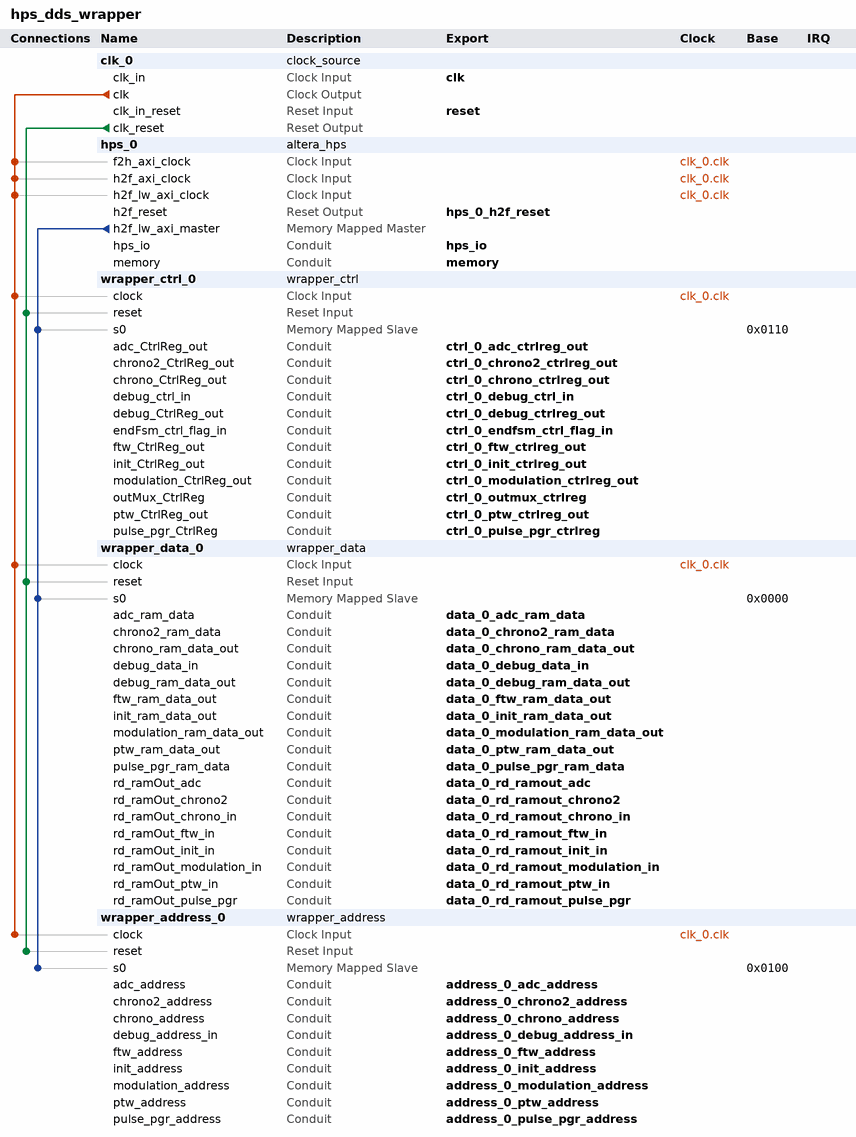
[diagram p0: system contents]
# Platform Designer (Qsys) system hps_dds_wrapper, Cyclone V 5CSEMA4U23C6
# Parameters at their usual value, and those the tool derives, are not listed.
package require -exact qsys 22.1
create_system hps_dds_wrapper
set_project_property DEVICE_FAMILY {Cyclone V}
set_project_property DEVICE 5CSEMA4U23C6

add_instance clk_0 clock_source 22.1
set_instance_parameter_value clk_0 clockFrequency 50000000

add_instance hps_0 altera_hps 22.1
set_instance_parameter_value hps_0 EMAC1_Mode RGMII
set_instance_parameter_value hps_0 EMAC1_PinMuxing {HPS I/O Set 0}
set_instance_parameter_value hps_0 F2SCLK_COLDRST_Enable false
set_instance_parameter_value hps_0 F2SCLK_DBGRST_Enable false
set_instance_parameter_value hps_0 F2SCLK_WARMRST_Enable false
set_instance_parameter_value hps_0 F2SINTERRUPT_Enable false
set_instance_parameter_value hps_0 F2S_Width 2
set_instance_parameter_value hps_0 FPGA_PERIPHERAL_OUTPUT_CLOCK_FREQ_EMAC0_GTX_CLK 125
set_instance_parameter_value hps_0 FPGA_PERIPHERAL_OUTPUT_CLOCK_FREQ_EMAC0_MD_CLK 2.5
set_instance_parameter_value hps_0 FPGA_PERIPHERAL_OUTPUT_CLOCK_FREQ_EMAC1_GTX_CLK 125
set_instance_parameter_value hps_0 FPGA_PERIPHERAL_OUTPUT_CLOCK_FREQ_EMAC1_MD_CLK 2.5
set_instance_parameter_value hps_0 HPS_PROTOCOL DDR3
set_instance_parameter_value hps_0 I2C0_Mode N/A
set_instance_parameter_value hps_0 I2C0_PinMuxing Unused
set_instance_parameter_value hps_0 I2C1_Mode N/A
set_instance_parameter_value hps_0 I2C1_PinMuxing Unused
set_instance_parameter_value hps_0 LWH2F_Enable true
set_instance_parameter_value hps_0 MEM_BANKADDR_WIDTH 3
set_instance_parameter_value hps_0 MEM_CLK_FREQ 400.0
set_instance_parameter_value hps_0 MEM_COL_ADDR_WIDTH 10
set_instance_parameter_value hps_0 MEM_DQ_WIDTH 32
set_instance_parameter_value hps_0 MEM_DRV_STR RZQ/7
set_instance_parameter_value hps_0 MEM_ROW_ADDR_WIDTH 15
set_instance_parameter_value hps_0 MEM_RTT_NOM RZQ/4
set_instance_parameter_value hps_0 MEM_RTT_WR {Dynamic ODT off}
set_instance_parameter_value hps_0 MEM_TCL 11
set_instance_parameter_value hps_0 MEM_TFAW_NS 37.5
set_instance_parameter_value hps_0 MEM_TRAS_NS 35.0
set_instance_parameter_value hps_0 MEM_TRCD_NS 13.75
set_instance_parameter_value hps_0 MEM_TRFC_NS 300.0
set_instance_parameter_value hps_0 MEM_TRP_NS 13.75
set_instance_parameter_value hps_0 MEM_VENDOR Other
set_instance_parameter_value hps_0 MEM_WTCL 8
set_instance_parameter_value hps_0 QSPI_Mode N/A
set_instance_parameter_value hps_0 QSPI_PinMuxing Unused
set_instance_parameter_value hps_0 REF_CLK_FREQ 25.0
set_instance_parameter_value hps_0 S2FCLK_USER2CLK 5
set_instance_parameter_value hps_0 S2F_Width 2
set_instance_parameter_value hps_0 SDIO_Mode {4-bit Data}
set_instance_parameter_value hps_0 SDIO_PinMuxing {HPS I/O Set 0}
set_instance_parameter_value hps_0 SPIM1_Mode N/A
set_instance_parameter_value hps_0 SPIM1_PinMuxing Unused
set_instance_parameter_value hps_0 STM_Enable false
set_instance_parameter_value hps_0 TIMING_BOARD_AC_SKEW 0.03
set_instance_parameter_value hps_0 TIMING_BOARD_AC_TO_CK_SKEW 0.0
set_instance_parameter_value hps_0 TIMING_BOARD_DQ_TO_DQS_SKEW 0.0
set_instance_parameter_value hps_0 TIMING_BOARD_MAX_CK_DELAY 0.03
set_instance_parameter_value hps_0 TIMING_BOARD_MAX_DQS_DELAY 0.02
set_instance_parameter_value hps_0 TIMING_BOARD_SKEW_BETWEEN_DQS 0.08
set_instance_parameter_value hps_0 TIMING_BOARD_SKEW_CKDQS_DIMM_MAX 0.16
set_instance_parameter_value hps_0 TIMING_BOARD_SKEW_CKDQS_DIMM_MIN 0.09
set_instance_parameter_value hps_0 TIMING_BOARD_SKEW_WITHIN_DQS 0.01
set_instance_parameter_value hps_0 TIMING_TDH 65
set_instance_parameter_value hps_0 TIMING_TDQSCK 400
set_instance_parameter_value hps_0 TIMING_TDQSQ 125
set_instance_parameter_value hps_0 TIMING_TDS 20
set_instance_parameter_value hps_0 TIMING_TIH 140
set_instance_parameter_value hps_0 TIMING_TIS 180
set_instance_parameter_value hps_0 TIMING_TQSH 0.38
set_instance_parameter_value hps_0 UART0_Mode {No Flow Control}
set_instance_parameter_value hps_0 UART0_PinMuxing {HPS I/O Set 0}
set_instance_parameter_value hps_0 USB1_Mode SDR
set_instance_parameter_value hps_0 USB1_PinMuxing {HPS I/O Set 0}
set_instance_parameter_value hps_0 desired_cfg_clk_mhz 100.0
set_instance_parameter_value hps_0 desired_qspi_clk_mhz 400.0

add_instance wrapper_ctrl_0 wrapper_ctrl 1.0

add_instance wrapper_data_0 wrapper_data 1.0

add_instance wrapper_address_0 wrapper_address 1.0

# connections
add_connection clk_0.clk hps_0.f2h_axi_clock clock
add_connection clk_0.clk hps_0.h2f_axi_clock clock
add_connection clk_0.clk hps_0.h2f_lw_axi_clock clock
add_connection clk_0.clk wrapper_address_0.clock clock
add_connection clk_0.clk wrapper_ctrl_0.clock clock
add_connection clk_0.clk wrapper_data_0.clock clock
add_connection clk_0.clk_reset wrapper_address_0.reset reset
add_connection clk_0.clk_reset wrapper_ctrl_0.reset reset
add_connection clk_0.clk_reset wrapper_data_0.reset reset
add_connection hps_0.h2f_lw_axi_master wrapper_address_0.s0 avalon
set_connection_parameter_value hps_0.h2f_lw_axi_master/wrapper_address_0.s0 baseAddress 0x0100
add_connection hps_0.h2f_lw_axi_master wrapper_ctrl_0.s0 avalon
set_connection_parameter_value hps_0.h2f_lw_axi_master/wrapper_ctrl_0.s0 baseAddress 0x0110
add_connection hps_0.h2f_lw_axi_master wrapper_data_0.s0 avalon
set_connection_parameter_value hps_0.h2f_lw_axi_master/wrapper_data_0.s0 baseAddress 0x0000

# exported interfaces
add_interface address_0_adc_address conduit end
set_interface_property address_0_adc_address EXPORT_OF wrapper_address_0.adc_address
add_interface address_0_chrono2_address conduit end
set_interface_property address_0_chrono2_address EXPORT_OF wrapper_address_0.chrono2_address
add_interface address_0_chrono_address conduit end
set_interface_property address_0_chrono_address EXPORT_OF wrapper_address_0.chrono_address
add_interface address_0_debug_address_in conduit end
set_interface_property address_0_debug_address_in EXPORT_OF wrapper_address_0.debug_address_in
add_interface address_0_ftw_address conduit end
set_interface_property address_0_ftw_address EXPORT_OF wrapper_address_0.ftw_address
add_interface address_0_init_address conduit end
set_interface_property address_0_init_address EXPORT_OF wrapper_address_0.init_address
add_interface address_0_modulation_address conduit end
set_interface_property address_0_modulation_address EXPORT_OF wrapper_address_0.modulation_address
add_interface address_0_ptw_address conduit end
set_interface_property address_0_ptw_address EXPORT_OF wrapper_address_0.ptw_address
add_interface address_0_pulse_pgr_address conduit end
set_interface_property address_0_pulse_pgr_address EXPORT_OF wrapper_address_0.pulse_pgr_address
add_interface clk clock sink
set_interface_property clk EXPORT_OF clk_0.clk_in
add_interface ctrl_0_adc_ctrlreg_out conduit end
set_interface_property ctrl_0_adc_ctrlreg_out EXPORT_OF wrapper_ctrl_0.adc_CtrlReg_out
add_interface ctrl_0_chrono2_ctrlreg_out conduit end
set_interface_property ctrl_0_chrono2_ctrlreg_out EXPORT_OF wrapper_ctrl_0.chrono2_CtrlReg_out
add_interface ctrl_0_chrono_ctrlreg_out conduit end
set_interface_property ctrl_0_chrono_ctrlreg_out EXPORT_OF wrapper_ctrl_0.chrono_CtrlReg_out
add_interface ctrl_0_debug_ctrl_in conduit end
set_interface_property ctrl_0_debug_ctrl_in EXPORT_OF wrapper_ctrl_0.debug_ctrl_in
add_interface ctrl_0_debug_ctrlreg_out conduit end
set_interface_property ctrl_0_debug_ctrlreg_out EXPORT_OF wrapper_ctrl_0.debug_CtrlReg_out
add_interface ctrl_0_endfsm_ctrl_flag_in conduit end
set_interface_property ctrl_0_endfsm_ctrl_flag_in EXPORT_OF wrapper_ctrl_0.endFsm_ctrl_flag_in
add_interface ctrl_0_ftw_ctrlreg_out conduit end
set_interface_property ctrl_0_ftw_ctrlreg_out EXPORT_OF wrapper_ctrl_0.ftw_CtrlReg_out
add_interface ctrl_0_init_ctrlreg_out conduit end
set_interface_property ctrl_0_init_ctrlreg_out EXPORT_OF wrapper_ctrl_0.init_CtrlReg_out
add_interface ctrl_0_modulation_ctrlreg_out conduit end
set_interface_property ctrl_0_modulation_ctrlreg_out EXPORT_OF wrapper_ctrl_0.modulation_CtrlReg_out
add_interface ctrl_0_outmux_ctrlreg conduit end
set_interface_property ctrl_0_outmux_ctrlreg EXPORT_OF wrapper_ctrl_0.outMux_CtrlReg
add_interface ctrl_0_ptw_ctrlreg_out conduit end
set_interface_property ctrl_0_ptw_ctrlreg_out EXPORT_OF wrapper_ctrl_0.ptw_CtrlReg_out
add_interface ctrl_0_pulse_pgr_ctrlreg conduit end
set_interface_property ctrl_0_pulse_pgr_ctrlreg EXPORT_OF wrapper_ctrl_0.pulse_pgr_CtrlReg
add_interface data_0_adc_ram_data conduit end
set_interface_property data_0_adc_ram_data EXPORT_OF wrapper_data_0.adc_ram_data
add_interface data_0_chrono2_ram_data conduit end
set_interface_property data_0_chrono2_ram_data EXPORT_OF wrapper_data_0.chrono2_ram_data
add_interface data_0_chrono_ram_data_out conduit end
set_interface_property data_0_chrono_ram_data_out EXPORT_OF wrapper_data_0.chrono_ram_data_out
add_interface data_0_debug_data_in conduit end
set_interface_property data_0_debug_data_in EXPORT_OF wrapper_data_0.debug_data_in
add_interface data_0_debug_ram_data_out conduit end
set_interface_property data_0_debug_ram_data_out EXPORT_OF wrapper_data_0.debug_ram_data_out
add_interface data_0_ftw_ram_data_out conduit end
set_interface_property data_0_ftw_ram_data_out EXPORT_OF wrapper_data_0.ftw_ram_data_out
add_interface data_0_init_ram_data_out conduit end
set_interface_property data_0_init_ram_data_out EXPORT_OF wrapper_data_0.init_ram_data_out
add_interface data_0_modulation_ram_data_out conduit end
set_interface_property data_0_modulation_ram_data_out EXPORT_OF wrapper_data_0.modulation_ram_data_out
add_interface data_0_ptw_ram_data_out conduit end
set_interface_property data_0_ptw_ram_data_out EXPORT_OF wrapper_data_0.ptw_ram_data_out
add_interface data_0_pulse_pgr_ram_data conduit end
set_interface_property data_0_pulse_pgr_ram_data EXPORT_OF wrapper_data_0.pulse_pgr_ram_data
add_interface data_0_rd_ramout_adc conduit end
set_interface_property data_0_rd_ramout_adc EXPORT_OF wrapper_data_0.rd_ramOut_adc
add_interface data_0_rd_ramout_chrono2 conduit end
set_interface_property data_0_rd_ramout_chrono2 EXPORT_OF wrapper_data_0.rd_ramOut_chrono2
add_interface data_0_rd_ramout_chrono_in conduit end
set_interface_property data_0_rd_ramout_chrono_in EXPORT_OF wrapper_data_0.rd_ramOut_chrono_in
add_interface data_0_rd_ramout_ftw_in conduit end
set_interface_property data_0_rd_ramout_ftw_in EXPORT_OF wrapper_data_0.rd_ramOut_ftw_in
add_interface data_0_rd_ramout_init_in conduit end
set_interface_property data_0_rd_ramout_init_in EXPORT_OF wrapper_data_0.rd_ramOut_init_in
add_interface data_0_rd_ramout_modulation_in conduit end
set_interface_property data_0_rd_ramout_modulation_in EXPORT_OF wrapper_data_0.rd_ramOut_modulation_in
add_interface data_0_rd_ramout_ptw_in conduit end
set_interface_property data_0_rd_ramout_ptw_in EXPORT_OF wrapper_data_0.rd_ramOut_ptw_in
add_interface data_0_rd_ramout_pulse_pgr conduit end
set_interface_property data_0_rd_ramout_pulse_pgr EXPORT_OF wrapper_data_0.rd_ramOut_pulse_pgr
add_interface hps_0_h2f_reset reset source
set_interface_property hps_0_h2f_reset EXPORT_OF hps_0.h2f_reset
add_interface hps_io conduit end
set_interface_property hps_io EXPORT_OF hps_0.hps_io
add_interface memory conduit end
set_interface_property memory EXPORT_OF hps_0.memory
add_interface reset reset sink
set_interface_property reset EXPORT_OF clk_0.clk_in_reset

set_interconnect_requirement {$system} qsys_mm.clockCrossingAdapter HANDSHAKE
set_interconnect_requirement {$system} qsys_mm.enableEccProtection FALSE
set_interconnect_requirement {$system} qsys_mm.insertDefaultSlave FALSE
set_interconnect_requirement {$system} qsys_mm.maxAdditionalLatency 1

save_system hps_dds_wrapper.qsys
